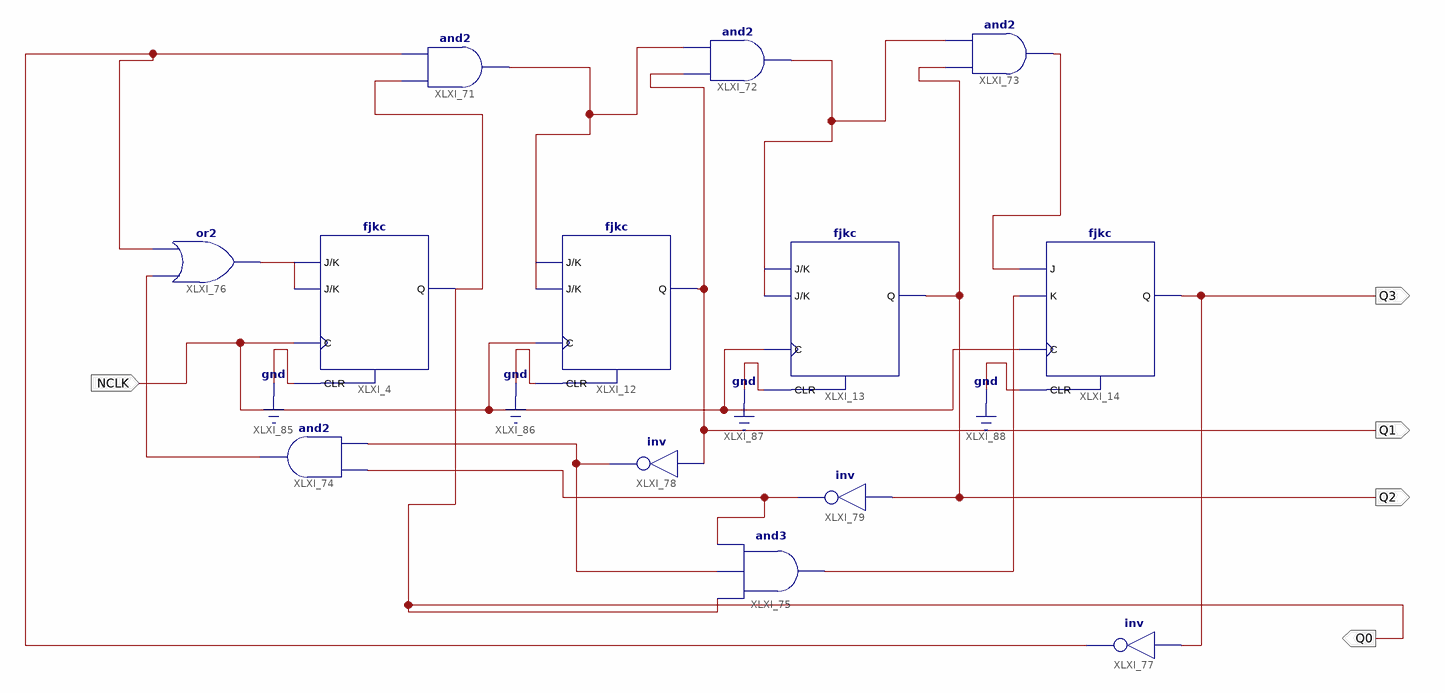
[diagram p0: schematic sheet 1]
// Xilinx ISE schematic Schematic1.sch (spartan6) as structural Verilog: 13 symbols, 5 ports
module Schematic1 (
  input  NCLK,
  output Q1,
  output Q2,
  output Q0,
  output Q3
);

  wire XLXN_153, XLXN_154, XLXN_155, XLXN_156, XLXN_160, XLXN_164, XLXN_166, XLXN_169, XLXN_175;

  fjkc XLXI_12 (.C(NCLK), .CLR(1'b0), .J(XLXN_154), .K(XLXN_154), .Q(Q1));
  fjkc XLXI_13 (.C(NCLK), .CLR(1'b0), .J(XLXN_155), .K(XLXN_155), .Q(Q2));
  fjkc XLXI_14 (.C(NCLK), .CLR(1'b0), .J(XLXN_169), .K(XLXN_175), .Q(Q3));
  fjkc XLXI_4 (.C(NCLK), .CLR(1'b0), .J(XLXN_153), .K(XLXN_153), .Q(Q0));
  and XLXI_71 (XLXN_154, Q0, XLXN_166);
  and XLXI_72 (XLXN_155, Q1, XLXN_154);
  and XLXI_73 (XLXN_169, Q2, XLXN_155);
  and XLXI_74 (XLXN_156, XLXN_164, XLXN_160);
  and XLXI_75 (XLXN_175, Q0, XLXN_164, XLXN_160);
  or XLXI_76 (XLXN_153, XLXN_156, XLXN_166);
  not XLXI_77 (XLXN_166, Q3);
  not XLXI_78 (XLXN_164, Q1);
  not XLXI_79 (XLXN_160, Q2);
endmodule
